# Altium schematic sheet BMS.SchDoc
size A2; SheetNumber: 3; SheetTotal: 10
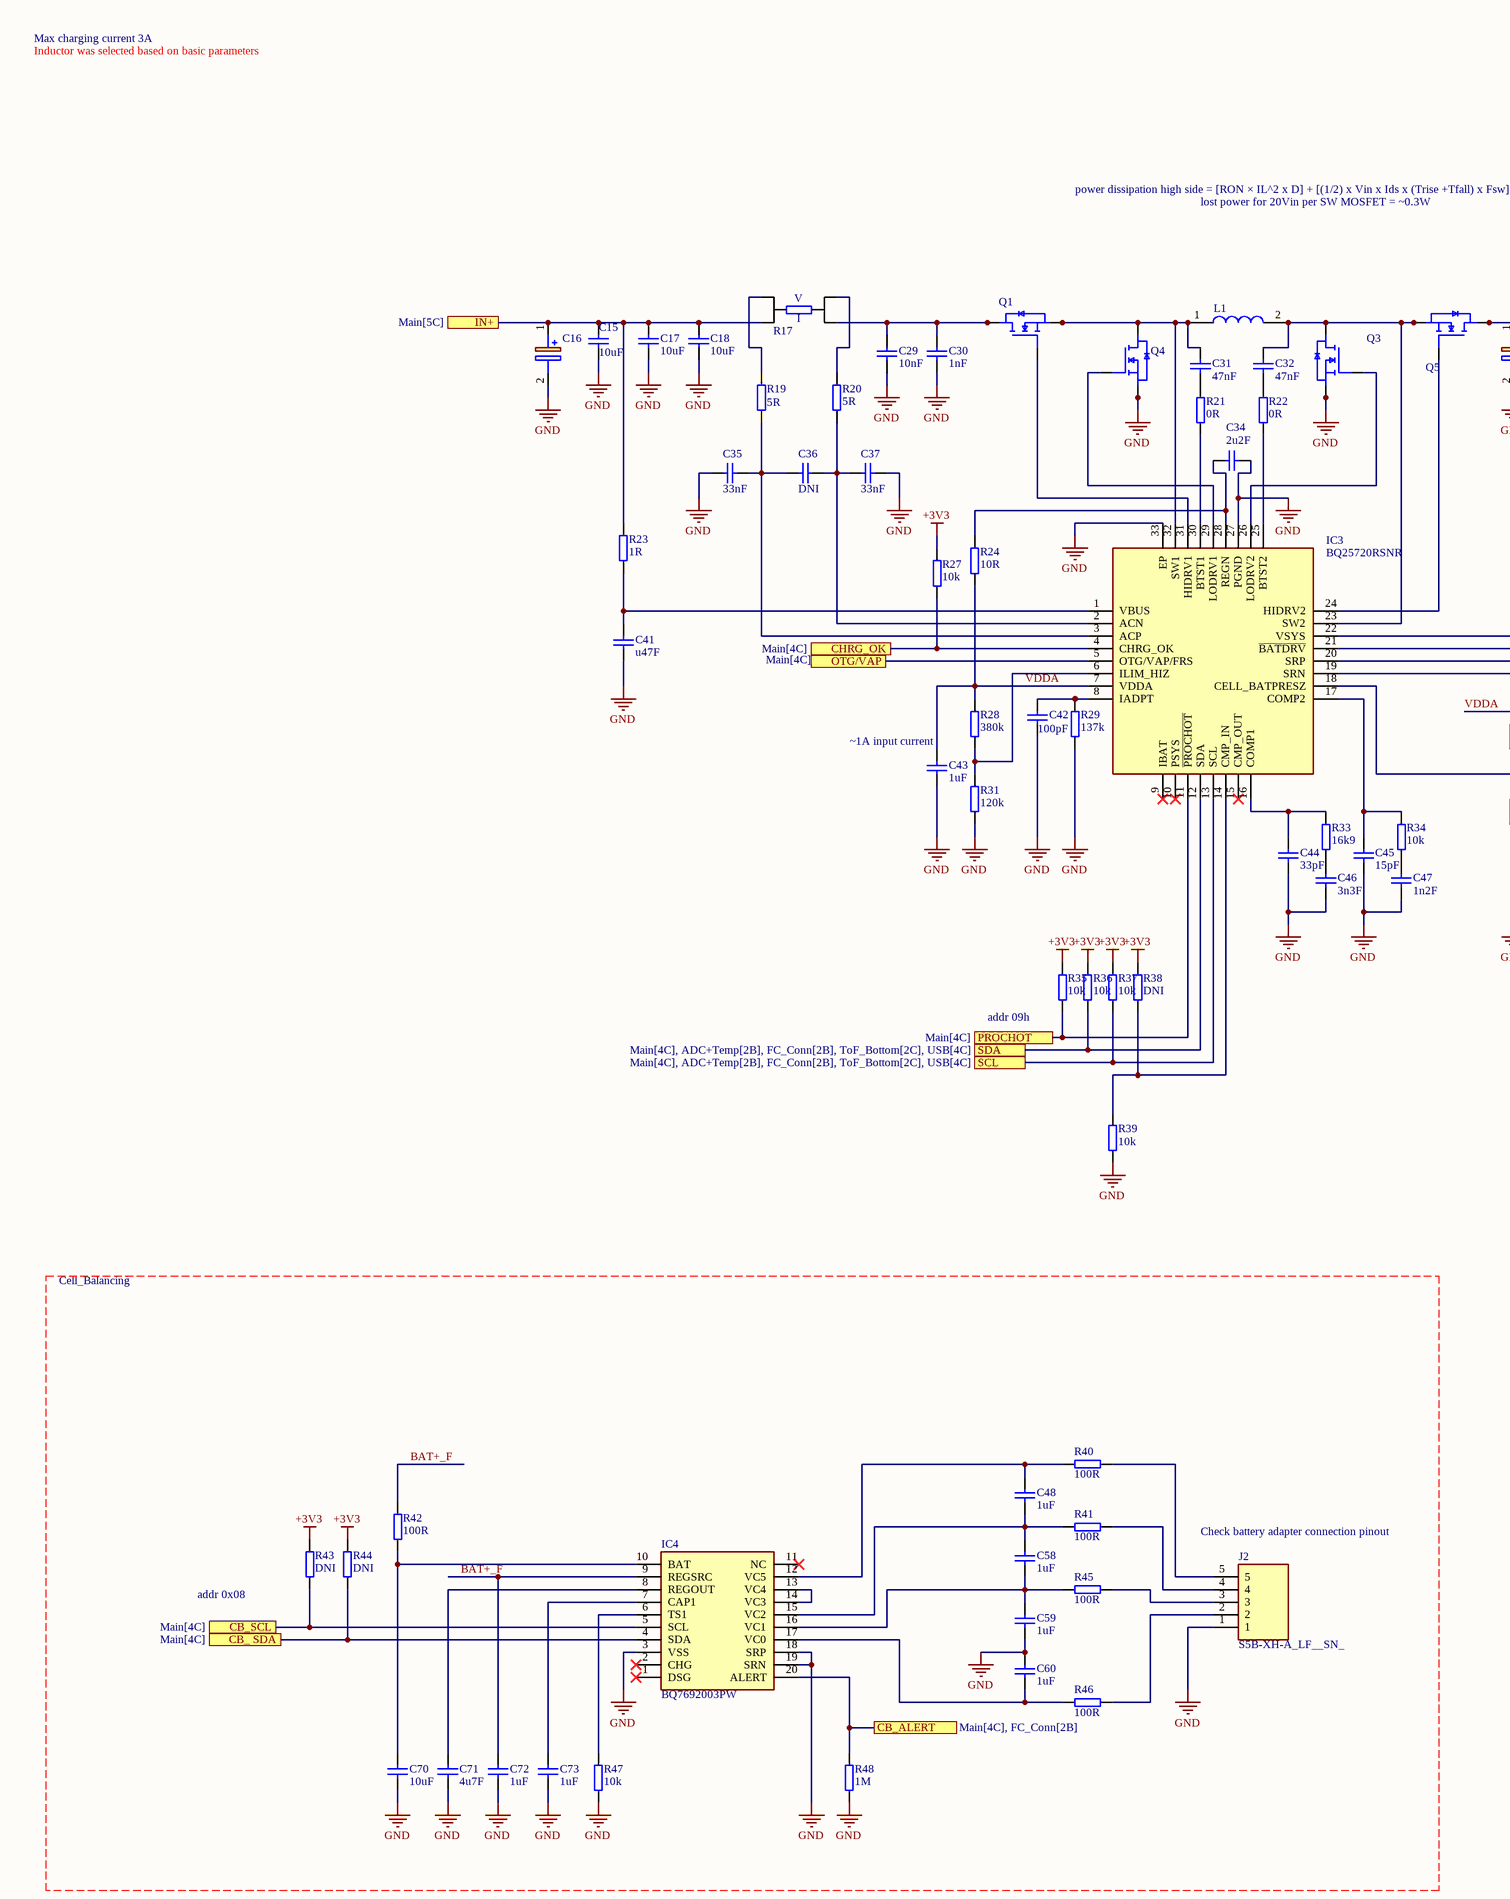
[diagram p0: BMS.SchDoc, left]
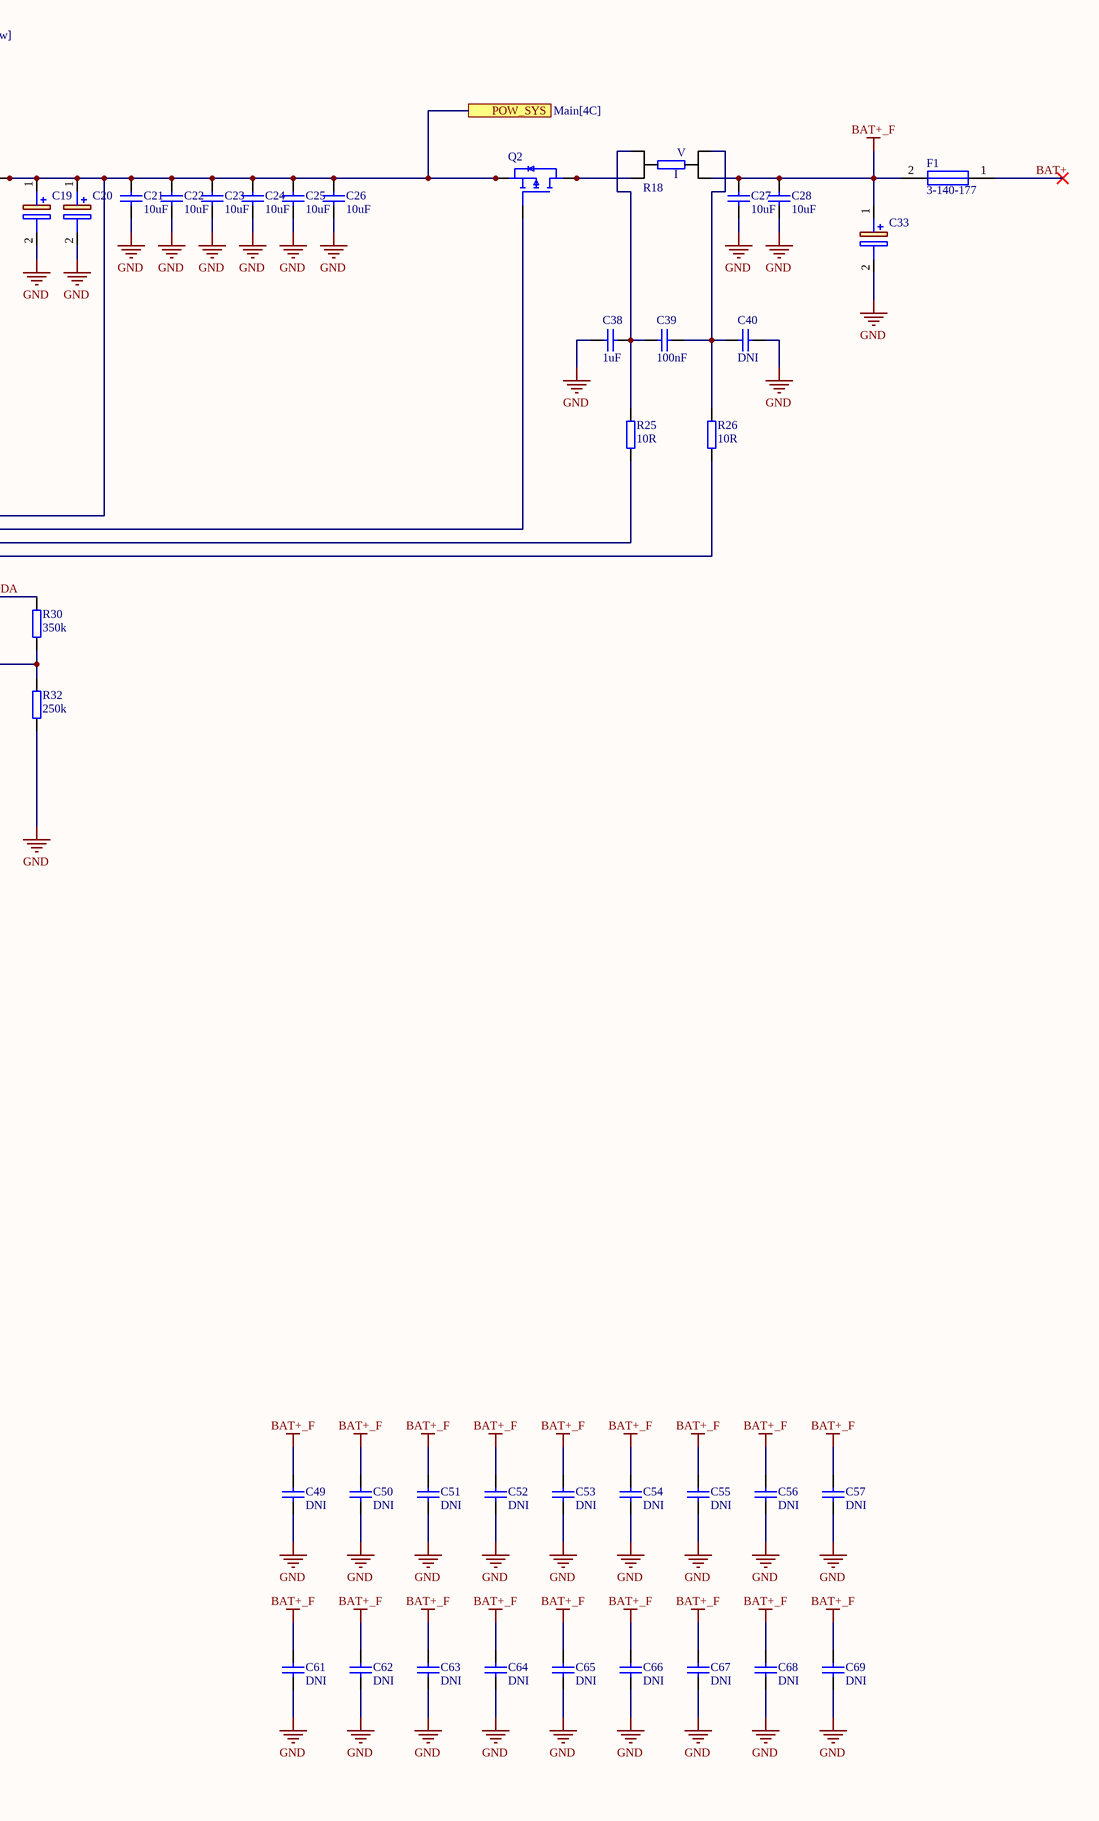
[diagram p1: BMS.SchDoc, right]

## Parts
C15  value 10uF  [CAP0603]  (hidden comment: Cap0603)
C16  TR3D336K025D0200  [CAPPM7343X310N]  (value not drawn)
C17  value 10uF  [CAP0805]  (hidden comment: Cap0805)
C18  value 10uF  [CAP0805]  (hidden comment: Cap0805)
C19  293D226X0025D2TE3  [CAPPM7343X310N]  (value not drawn)
C20  293D226X0025D2TE3  [CAPPM7343X310N]  (value not drawn)
C21  value 10uF  [CAP0805]  (hidden comment: Cap0805)
C22  value 10uF  [CAP0805]  (hidden comment: Cap0805)
C23  value 10uF  [CAP0805]  (hidden comment: Cap0805)
C24  value 10uF  [CAP0805]  (hidden comment: Cap0805)
C25  value 10uF  [CAP0805]  (hidden comment: Cap0805)
C26  value 10uF  [CAP0805]  (hidden comment: Cap0805)
C27  value 10uF  [CAP0805]  (hidden comment: Cap0805)
C28  value 10uF  [CAP0805]  (hidden comment: Cap0805)
C29  value 10nF  [CAP0402]  (hidden comment: Cap0402)
C30  value 1nF  [CAP0402]  (hidden comment: Cap0402)
C31  value 47nF  [CAP0402]  (hidden comment: Cap0402)
C32  value 47nF  [CAP0402]  (hidden comment: Cap0402)
C33  EEH-ZL1V151XP  [EEEHP1H4R7P]  (value not drawn)
C34  value 2u2F  [CAP0402]  (hidden comment: Cap0402)
C35  value 33nF  [CAP0402]  (hidden comment: Cap0402)
C36  value DNI  [CAP0402]  (hidden comment: Cap0402)
C37  value 33nF  [CAP0402]  (hidden comment: Cap0402)
C38  value 1uF  [CAP0402]  (hidden comment: Cap0402)
C39  value 100nF  [CAP0402]  (hidden comment: Cap0402)
C40  value DNI  [CAP0402]  (hidden comment: Cap0402)
C41  value u47F  [CAP0603]  (hidden comment: Cap0603)
C42  value 100pF  [CAP0402]  (hidden comment: Cap0402)
C43  value 1uF  [CAP0402]  (hidden comment: Cap0402)
C44  value 33pF  [CAP0402]  (hidden comment: Cap0402)
C45  value 15pF  [CAP0402]  (hidden comment: Cap0402)
C46  value 3n3F  [CAP0402]  (hidden comment: Cap0402)
C47  value 1n2F  [CAP0402]  (hidden comment: Cap0402)
C48  value 1uF  [CAP0402]  (hidden comment: Cap0402)
C49  value DNI  [CAP0805]  (hidden comment: Cap0805)
C50  value DNI  [CAP0805]  (hidden comment: Cap0805)
C51  value DNI  [CAP0805]  (hidden comment: Cap0805)
C52  value DNI  [CAP0805]  (hidden comment: Cap0805)
C53  value DNI  [CAP0805]  (hidden comment: Cap0805)
C54  value DNI  [CAP0805]  (hidden comment: Cap0805)
C55  value DNI  [CAP0805]  (hidden comment: Cap0805)
C56  value DNI  [CAP0805]  (hidden comment: Cap0805)
C57  value DNI  [CAP0805]  (hidden comment: Cap0805)
C58  value 1uF  [CAP0402]  (hidden comment: Cap0402)
C59  value 1uF  [CAP0402]  (hidden comment: Cap0402)
C60  value 1uF  [CAP0402]  (hidden comment: Cap0402)
C61  value DNI  [CAP0805]  (hidden comment: Cap0805)
C62  value DNI  [CAP0805]  (hidden comment: Cap0805)
C63  value DNI  [CAP0805]  (hidden comment: Cap0805)
C64  value DNI  [CAP0805]  (hidden comment: Cap0805)
C65  value DNI  [CAP0805]  (hidden comment: Cap0805)
C66  value DNI  [CAP0805]  (hidden comment: Cap0805)
C67  value DNI  [CAP0805]  (hidden comment: Cap0805)
C68  value DNI  [CAP0805]  (hidden comment: Cap0805)
C69  value DNI  [CAP0805]  (hidden comment: Cap0805)
C70  value 10uF  [CAP0805]  (hidden comment: Cap0805)
C71  value 4u7F  [CAP0805]  (hidden comment: Cap0402)
C72  value 1uF  [CAP0402]  (hidden comment: Cap0402)
C73  value 1uF  [CAP0402]  (hidden comment: Cap0402)
F1  3-140-177  [3140177]
IC3  BQ25720RSNR  [QFN40P400X400X80-33N-D]
IC4  BQ7692003PW  [SOP65P640X120-20N]
J2  S5B-XH-A_LF__SN_  [SHDRRA5W64P0X250_1X5_1490X1150X610P]
L1  XEL4020-222MEC  [XEL4020222MEC]  (value not drawn)
Q1  PMPB07R3ENAX  [DMT3006LFDF7]  (value not drawn)
Q2  SISA01DN-T1-GE3  [SIS862DNT1GE3]  (value not drawn)
Q3  PMPB07R3ENAX  [DMT3006LFDF7]  (value not drawn)
Q4  PMPB07R3ENAX  [DMT3006LFDF7]  (value not drawn)
Q5  PMPB07R3ENAX  [DMT3006LFDF7]  (value not drawn)
R17  L4CA0612LR010FNR  [L4CA0612L0M50FNR]  (value not drawn)
R18  L4CA0612LR010FNR  [L4CA0612L0M50FNR]  (value not drawn)
R19  value 5R  [RES0402]  (hidden comment: Res0402)
R20  value 5R  [RES0402]  (hidden comment: Res0402)
R21  value 0R  [RES0402]  (hidden comment: Res0402)
R22  value 0R  [RES0402]  (hidden comment: Res0402)
R23  value 1R  [RES0603]  (hidden comment: Res0603)
R24  value 10R  [RES0402]  (hidden comment: Res0402)
R25  value 10R  [RES0402]  (hidden comment: Res0402)
R26  value 10R  [RES0402]  (hidden comment: Res0402)
R27  value 10k  [RES0402]  (hidden comment: Res0402)
R28  value 380k  [RES0402]  (hidden comment: Res0402)
R29  value 137k  [RES0402]  (hidden comment: Res0402)
R30  value 350k  [RES0402]  (hidden comment: Res0402)
R31  value 120k  [RES0402]  (hidden comment: Res0402)
R32  value 250k  [RES0402]  (hidden comment: Res0402)
R33  value 16k9  [RES0402]  (hidden comment: Res0402)
R34  value 10k  [RES0402]  (hidden comment: Res0402)
R35  value 10k  [RES0402]  (hidden comment: Res0402)
R36  value 10k  [RES0402]  (hidden comment: Res0402)
R37  value 10k  [RES0402]  (hidden comment: Res0402)
R38  value DNI  [RES0402]  (hidden comment: Res0402)
R39  value 10k  [RES0402]  (hidden comment: Res0402)
R40  value 100R  [RES0805]  (hidden comment: Res0805)
R41  value 100R  [RES0805]  (hidden comment: Res0805)
R42  value 100R  [RES0402]  (hidden comment: Res0805)
R43  value DNI  [RES0402]  (hidden comment: Res0402)
R44  value DNI  [RES0402]  (hidden comment: Res0402)
R45  value 100R  [RES0805]  (hidden comment: Res0805)
R46  value 100R  [RES0805]  (hidden comment: Res0805)
R47  value 10k  [RES0402]  (hidden comment: Res0402)
R48  value 1M  [RES0402]  (hidden comment: Res0402)

## Ports
CB_ SDA (see Main[4C]), CB_ALERT (see Main[4C], FC_Conn[2B]), CB_SCL (see Main[4C]), CHRG_OK (see Main[4C]), IN+ (see Main[5C]), OTG/VAP (see Main[4C]), POW_SYS (see Main[4C]), PROCHOT (see Main[4C]), SCL (see Main[4C], ADC+Temp[2B], FC_Conn[2B], ToF_Bottom[2C], USB[4C]), SDA (see Main[4C], ADC+Temp[2B], FC_Conn[2B], ToF_Bottom[2C], USB[4C])

## Nets
+3V3: R27.2 R35.2 R36.2 R37.2 R38.2 R43.2 R44.2
BAT+_F: C27.2 C28.2 C33.1(+) C49.2 C50.2 C51.2 C52.2 C53.2 C54.2 C55.2 C56.2 C57.2 C61.2 C62.2 C63.2 C64.2 C65.2 C66.2 C67.2 C68.2 C69.2 C72.2 F1.2 IC4.9(REGSRC) R18.2 R42.2
GND: C15.1 C16.2(-) C17.1 C18.1 C19.2(-) C20.2(-) C21.1 C22.1 C23.1 C24.1 C25.1 C26.1 C27.1 C28.1 C29.1 C30.1 C33.2(-) C34.1 C35.1 C37.2 C38.1 C40.2 C41.1 C42.1 C43.1 C44.1 C45.1 C46.1 C47.1 C49.1 C50.1 C51.1 C52.1 C53.1 C54.1 C55.1 C56.1 C57.1 C59.1 C60.2 C61.1 C62.1 C63.1 C64.1 C65.1 C66.1 C67.1 C68.1 C69.1 C70.1 C71.1 C72.1 C73.1 IC3.27(PGND) IC3.33(EP) IC4.3(VSS) IC4.18(SRP) IC4.19(SRN) J2.1 Q3.4(S_1) Q3.8(S_2) Q4.4(S_1) Q4.8(S_2) R29.1 R31.1 R32.1 R39.1 R47.1 R48.1
BAT+: F1.1
CB_ SDA: IC4.4(SDA) R44.1 ; port CB_ SDA
CB_ALERT: IC4.20(ALERT) R48.2 ; port CB_ALERT
CB_SCL: IC4.5(SCL) R43.1 ; port CB_SCL
CHRG_OK: IC3.4(CHRG_OK) R27.1 ; port CHRG_OK
IN+: C15.2 C16.1(+) C17.2 C18.2 R17.2 R23.2 ; port IN+
OTG/VAP: IC3.5(OTG/VAP/FRS) ; port OTG/VAP
POW_SYS: C19.1(+) C20.1(+) C21.2 C22.2 C23.2 C24.2 C25.2 C26.2 IC3.22(VSYS) Q2.1(S_1) Q2.2(S_2) Q2.3(S_3) Q5.1(D_1) Q5.2(D_2) Q5.5(D_3) Q5.6(D_4) Q5.7(D_5) ; port POW_SYS
PROCHOT: IC3.11(~{PROCHOT}) R35.1 ; port PROCHOT
SCL: IC3.13(SCL) R37.1 ; port SCL
SDA: IC3.12(SDA) R36.1 ; port SDA
VDDA: C43.2 IC3.7(VDDA) R24.2 R28.2 R30.2
NetC29_2: C29.2 C30.2 Q1.1(D_1) Q1.2(D_2) Q1.5(D_3) Q1.6(D_4) Q1.7(D_5) R17.3
NetC31_1: C31.1 R21.2
NetC31_2: C31.2 IC3.32(SW1) L1.1 Q1.4(S_1) Q1.8(S_2) Q4.1(D_1) Q4.2(D_2) Q4.5(D_3) Q4.6(D_4) Q4.7(D_5)
NetC32_1: C32.1 R22.2
NetC32_2: C32.2 IC3.23(SW2) L1.2 Q3.1(D_1) Q3.2(D_2) Q3.5(D_3) Q3.6(D_4) Q3.7(D_5) Q5.4(S_1) Q5.8(S_2)
NetC34_2: C34.2 IC3.28(REGN) R24.1
NetC35_2: C35.2 C36.1 IC3.3(ACP) R19.1
NetC36_2: C36.2 C37.1 IC3.2(ACN) R20.1
NetC38_2: C38.2 C39.1 R18.4 R25.2
NetC39_2: C39.2 C40.1 R18.1 R26.2
NetC41_2: C41.2 IC3.1(VBUS) R23.1
NetC42_2: C42.2 IC3.8(IADPT) R29.2
NetC44_2: C44.2 IC3.16(COMP1) R33.2
NetC45_2: C45.2 IC3.17(COMP2) R34.2
NetC46_2: C46.2 R33.1
NetC47_2: C47.2 R34.1
NetC48_1: C48.1 C58.2 IC4.15(VC2) R41.1
NetC48_2: C48.2 IC4.12(VC5) R40.1
NetC58_1: C58.1 C59.2 IC4.16(VC1) R45.1
NetC60_1: C60.1 IC4.17(VC0) R46.1
NetC70_2: C70.2 IC4.10(BAT) R42.1
NetC71_2: C71.2 IC4.8(REGOUT)
NetC73_2: C73.2 IC4.7(CAP1)
NetIC3_6: IC3.6(ILIM_HIZ) R28.1 R31.2
NetIC3_14: IC3.14(CMP_IN) R38.1 R39.2
NetIC3_18: IC3.18(CELL_BATPRESZ) R30.1 R32.2
NetIC3_19: IC3.19(SRN) R26.1
NetIC3_20: IC3.20(SRP) R25.1
NetIC3_21: IC3.21(~{BATDRV}) Q2.4(G)
NetIC3_24: IC3.24(HIDRV2) Q5.3(G)
NetIC3_25: IC3.25(BTST2) R22.1
NetIC3_26: IC3.26(LODRV2) Q3.3(G)
NetIC3_29: IC3.29(LODRV1) Q4.3(G)
NetIC3_30: IC3.30(BTST1) R21.1
NetIC3_31: IC3.31(HIDRV1) Q1.3(G)
NetIC4_6: IC4.6(TS1) R47.2
NetIC4_13: IC4.13(VC4) IC4.14(VC3)
NetJ2_2: J2.2 R46.2
NetJ2_3: J2.3 R45.2
NetJ2_4: J2.4 R41.2
NetJ2_5: J2.5 R40.2
NetQ2_5: Q2.5(D_1) Q2.6(D_2) Q2.7(D_3) Q2.8(D_4) Q2.9(D_4) R18.3
NetR17_1: R17.1 R19.2
NetR17_4: R17.4 R20.2

Not connected (* = marked no-connect by the designer): IC3 9(IBAT)* 10(PSYS)* 15(CMP_OUT)*; IC4 1(DSG)* 2(CHG)* 11(NC)*

## Notes on the sheet
- Max charging current 3A
- Inductor was selected based on basic parameters
- power dissipation high side = [RON × IL^2 x D] + [(1/2) x Vin x Ids x (Trise +Tfall) x Fsw]
- lost power for 20Vin per SW MOSFET = ~0.3W
- (near C43) ~1A input current
- (near R35) addr 09h
- Cell_Balancing
- (near J2) Check battery adapter connection pinout
- addr 0x08
- (in symbol L4CA0612LR010FNR) V; I

## Library data of the parts
C15 = Cap0603: Manufacturer_Part_Number: GRM188R61E106MA73J; Voltage: 25V
C16 = TR3D336K025D0200: Capacitor Polarised; Manufacturer_Name: Vishay; Value: 33uF; Datasheet Link: http://www.vishay.com/doc?40080; Height: 3.1mm; Manufacturer_Part_Number: TR3D336K025D0200; Mouser Part Number: 74-TR3D336K025D0200; Mouser Price/Stock: https://www.mouser.com/Search/Refine.aspx?Keyword=74-TR3D336K025D0200
C17 C18 C21-C28 = Cap0805: Manufacturer_Part_Number: GRM21BR61H106KE43K; Voltage: 50V
C19 C20 = 293D226X0025D2TE3: Capacitor Polarised; Manufacturer_Name: Vishay; Value: 22uF; Datasheet Link: http://www.vishay.com/docs/40002/293d.pdf; Height: 3.1mm; Manufacturer_Part_Number: 293D226X0025D2TE3; Mouser Part Number: 74-293D226X0025D2TE3; Mouser Price/Stock: https://www.mouser.co.uk/ProductDetail/Vishay-Sprague/293D226X0025D2TE3?qs=27QRfRkF2isTHSjSebANCw%3D%3D
C29 = Cap0402: Manufacturer_Part_Number: GRM155R71H103MA88D; Voltage: 50V
C30 = Cap0402: Manufacturer_Part_Number: GRM155R71H102KA01J; Voltage: 50V
C31 C32 = Cap0402: Manufacturer_Part_Number: GRM155R61H473KE14D; Voltage: 50V
C33 = EEH-ZL1V151XP: Capacitor Polarised; Manufacturer_Name: Panasonic; Datasheet Link: https://industrial.panasonic.com/cdbs/www-data/pdf/RDD0000/ast-ind-303928.pdf; Manufacturer_Part_Number: EEH-ZL1V151XP
C34 = Cap0402: Manufacturer_Part_Number: GRM155R6YA225KE11J; Voltage: 25V
C35 C37 = Cap0402: Manufacturer_Part_Number: GRM155R61H333KE14D; Voltage: 6V3
C38 C43 C48 C58-C60 C72 C73 = Cap0402: Manufacturer_Part_Number: GRM155R61H105KE05J; Voltage: 50V
C39 = Cap0402: Manufacturer_Part_Number: GRM155R71H104ME14D; Voltage: 50V
C41 = Cap0603: Manufacturer_Part_Number: GRM188R61H474KA12D; Voltage: 25V
C42 = Cap0402: Manufacturer_Part_Number: C0402C101K5RACAUTO; Voltage: 50V
C44 = Cap0402: Manufacturer_Part_Number: 04025C330JAT2A; Voltage: 25V
C45 = Cap0402: Manufacturer_Part_Number: C0402C150K5RACAUTO; Voltage: 25V
C46 = Cap0402: Manufacturer_Part_Number: GRM155R71H332KA01D; Voltage: 25V
C47 = Cap0402: Manufacturer_Part_Number: GCM155R71H122KA37D; Voltage: 25V
C70 = Cap0805: Voltage: 50V
C71 = Cap0402: Manufacturer_Part_Number: CM05X5R475M25AH; Voltage: 50V
F1 = 3-140-177: Fuse; Manufacturer_Name: SCHURTER; Datasheet Link: https://www.schurter.com/en/datasheet/typ_UHS.pdf; Height: 4.85mm; Manufacturer_Part_Number: 3-140-177; Mouser Part Number: 693-3-140-177; Mouser Price/Stock: https://www.mouser.co.uk/ProductDetail/Schurter/3-140-177?qs=3Rah4i%252BhyCHL3c0yS6dOkg%3D%3D; Arrow Part Number: 3-140-177; Arrow Price/Stock: https://www.arrow.com/en/products/3-140-177/schurter?region=europe
IC3 = BQ25720RSNR: Integrated Circuit; Manufacturer_Name: Texas Instruments; Datasheet Link: https://www.ti.com/lit/ds/symlink/bq25720.pdf?ts=1649085131820&ref_url=https%253A%252F%252Fwww.ti.com%252Fproduct%252FBQ25720; Height: 0.8mm; Manufacturer_Part_Number: BQ25720RSNR; Mouser Part Number: 595-BQ25720RSNR; Mouser Price/Stock: https://www.mouser.co.uk/ProductDetail/Texas-Instruments/BQ25720RSNR?qs=ljCeji4nMDlwF8f%2Foae7aQ%3D%3D
IC4 = BQ7692003PW: Integrated Circuit; Manufacturer_Name: Texas Instruments; Datasheet Link: http://www.ti.com/lit/gpn/BQ76920; Height: 1.2mm; Manufacturer_Part_Number: BQ7692003PW; Mouser Part Number: 595-BQ7692003PW; Mouser Price/Stock: https://www.mouser.co.uk/ProductDetail/Texas-Instruments/BQ7692003PW?qs=%2Fd%252BFzHvH4c0Hx6X3GvdboA%3D%3D; Arrow Part Number: BQ7692003PW; Arrow Price/Stock: https://www.arrow.com/en/products/bq7692003pw/texas-instruments?utm_currency=USD&region=nac
J2 = S5B-XH-A_LF__SN_: Connector; Manufacturer_Name: JST (JAPAN SOLDERLESS TERMINALS); Manufacturer_Part_Number: S5B-XH-A(LF)(SN); Datasheet Link: http://www.jst-mfg.com/product/pdf/eng/eXH.pdf; Height: 6.1mm; Mouser Part Number: 306-S5B-XH-ALFSN; Mouser Price/Stock: https://www.mouser.co.uk/ProductDetail/JST-Commercial/S5B-XH-ALFSN?qs=QpmGXVUTftFJm7Okp%252B2lFg%3D%3D; Arrow Part Number: S5B-XH-A(LF)(SN); Arrow Price/Stock: https://www.arrow.com/en/products/s5b-xh-a-lf-sn/jst-manufacturing?utm_currency=USD&region=europe
L1 = XEL4020-222MEC: Inductor; Manufacturer_Name: COILCRAFT; Height: 2.1mm; Manufacturer_Part_Number: XEL4020-222MEC; Mouser Part Number: 994-XEL4020-222MEC; Mouser Price/Stock: https://www.mouser.co.uk/ProductDetail/Coilcraft/XEL4020-222MEC?qs=chTDxNqvsynf4rqMeCpizg%3D%3D
Q1 Q3-Q5 = DMT3006LFDF-7: MOSFET (N-Channel); Manufacturer_Name: Diodes Incorporated; Datasheet Link: https://www.arrow.com/en/products/dmt3006lfdf-7/diodes-incorporated; Height: 0.63mm; Manufacturer_Part_Number: DMT3006LFDF-7; Mouser Part Number: 621-DMT3006LFDF-7; Mouser Price/Stock: https://www.mouser.co.uk/ProductDetail/Diodes-Incorporated/DMT3006LFDF-7?qs=4EhzHfbM1GhGS5nn3gf3wg%3D%3D; Arrow Part Number: DMT3006LFDF-7; Arrow Price/Stock: https://www.arrow.com/en/products/dmt3006lfdf-7/diodes-incorporated
Q2 = SISA01DN-T1-GE3: MOSFET (P-Channel); Manufacturer_Name: Vishay; Datasheet Link: https://www.vishay.com/docs/76198/sisa01dn.pdf; Manufacturer_Part_Number: SISA01DN-T1-GE3; Mouser Part Number: 78-SISA01DN-T1-GE3; Mouser Price/Stock: https://www.mouser.co.uk/ProductDetail/Vishay-Semiconductors/SISA01DN-T1-GE3?qs=chTDxNqvsymq6IcOj9ze4g%3D%3D; Arrow Part Number: SISA01DN-T1-GE3; Arrow Price/Stock: https://www.arrow.com/en/products/sisa01dn-t1-ge3/vishay?region=nac
R17 R18 = L4CA0612LR010FNR: Resistor; Manufacturer_Name: LITTELFUSE; Datasheet Link: https://www.littelfuse.com/media?resourcetype=datasheets&itemid=db674d7b-aa25-4173-816a-92297475a59f&filename=littelfuse-resistor-l4ca-c-datasheet; Height: 0.7mm; Manufacturer_Part_Number: L4CA0612LR010FNR
R19 R20 = Res0402: Manufacturer_Part_Number: RT0402FRE075R1L
R21 R22 = Res0402: Manufacturer_Part_Number: RCA04020000ZSED
R23 = Res0603: Manufacturer_Part_Number: MCT06030C1008FP500
R24-R26 = Res0402: Manufacturer_Part_Number: AA0402JR-0710RL
R27 R34-R37 R39 R47 = Res0402: Manufacturer_Part_Number: ERA-2AED103X
R28 = Res0402: Manufacturer_Part_Number: RC0402FR-07383KL
R29 = Res0402: Manufacturer_Part_Number: CRCW0402137KFKED
R30 = Res0402: Manufacturer_Part_Number: CRCW0402348KFKEDC
R31 = Res0402: Manufacturer_Part_Number: AF0402FR-07120KL
R32 = Res0402: Manufacturer_Part_Number: CRCW0402249KFKEDC
R33 = Res0402: Manufacturer_Part_Number: ERA-2AEB1692X
R40 R41 R45 R46 = Res0805: Manufacturer_Part_Number: CMP0805-FX-1000ELF
R48 = Res0402: Manufacturer_Part_Number: RK73H1ETTP1004F
C36 C40 = Cap0402: Voltage: DNI
C49-C57 C61-C69 = Cap0805: Voltage: DNI